# Altium schematic sheet Camera.SchDoc: Access Control
size A; DrawnBy: Q.Thang & T.Khoa; Revision: V1.0.1; SheetNumber: 9; SheetTotal: 16
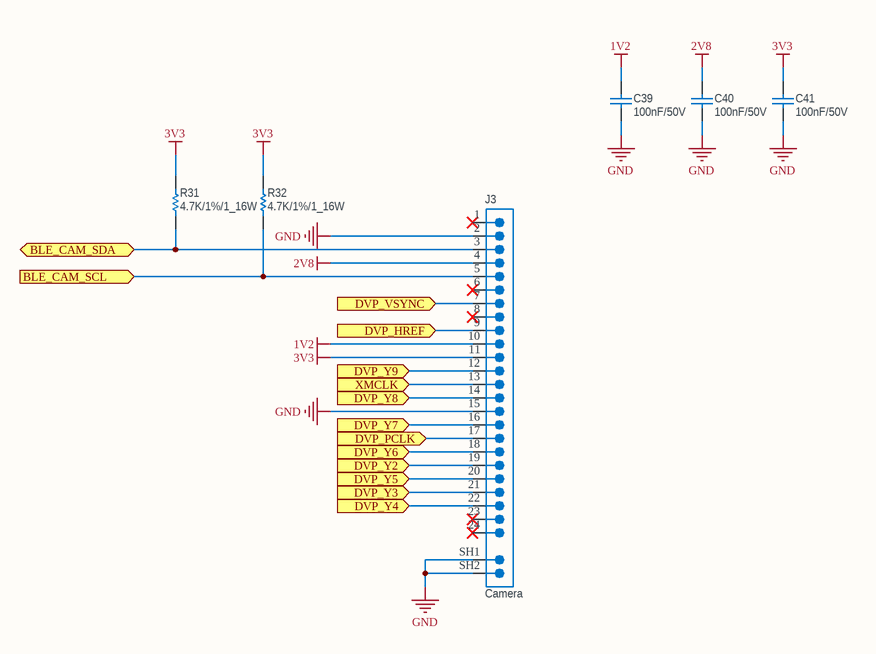
[diagram p0: Camera.SchDoc]

## Parts
C39  100nF/50V  [CAP_0402]
C40  100nF/50V  [CAP_0402]
C41  100nF/50V  [CAP_0402]
J3  Camera  [FPC_0.5mm_24P]
R31  4.7K/1%/1_16W  [RESISTOR_0402]
R32  4.7K/1%/1_16W  [RESISTOR_0402]

## Ports
BLE_CAM_SCL (in, see Overview_Schematic[3B], ESP32_BLE[3B]), BLE_CAM_SDA (bidir, see Overview_Schematic[3B], ESP32_BLE[2B]), DVP_HREF (in, see Overview_Schematic[3B], ESP32_BLE[3B]), DVP_PCLK (in, see Overview_Schematic[3B], ESP32_BLE[2B]), DVP_VSYNC (in, see Overview_Schematic[3B], ESP32_BLE[2B]), DVP_Y2 (in, see Overview_Schematic[3B], ESP32_BLE[3A]), DVP_Y3 (in, see Overview_Schematic[3B], ESP32_BLE[2B]), DVP_Y4 (in, see Overview_Schematic[3B], ESP32_BLE[2B]), DVP_Y5 (in, see Overview_Schematic[3B], ESP32_BLE[3A]), DVP_Y6 (in, see Overview_Schematic[3B], ESP32_BLE[3B]), DVP_Y7 (in, see Overview_Schematic[3B], ESP32_BLE[2B]), DVP_Y8 (in, see Overview_Schematic[3B], ESP32_BLE[2B]), DVP_Y9 (in, see Overview_Schematic[3B], ESP32_BLE[2B]), XMCLK (in, see Overview_Schematic[3B], ESP32_BLE[2B])

## Nets
1V2: C39.2 J3.10
2V8: C40.2 J3.4
3V3: C41.2 J3.11 R31.2 R32.2
GND: C39.1 C40.1 C41.1 J3.2 J3.15 J3.SH1(SHIELD) J3.SH2(SHIELD)
BLE_CAM_SCL: J3.5 R32.1 ; port BLE_CAM_SCL
BLE_CAM_SDA: J3.3 R31.1 ; port BLE_CAM_SDA
DVP_HREF: J3.9 ; port DVP_HREF
DVP_PCLK: J3.17 ; port DVP_PCLK
DVP_VSYNC: J3.7 ; port DVP_VSYNC
DVP_Y2: J3.19 ; port DVP_Y2
DVP_Y3: J3.21 ; port DVP_Y3
DVP_Y4: J3.22 ; port DVP_Y4
DVP_Y5: J3.20 ; port DVP_Y5
DVP_Y6: J3.18 ; port DVP_Y6
DVP_Y7: J3.16 ; port DVP_Y7
DVP_Y8: J3.14 ; port DVP_Y8
DVP_Y9: J3.12 ; port DVP_Y9
XMCLK: J3.13 ; port XMCLK

Not connected (* = marked no-connect by the designer): J3 1* 6* 8* 23* 24*

## Notes on the sheet
- Project Name
- Size
- A4
- Revision
- Checked By:
- Drawn By:
- Date:
- File:
- Last Modified:
- Sheet
- of

## Library data of the parts
C39-C41 = Ceramic_Cap_100nF_50V_0402: CAP, size 0402, 100nF, 50V; Supply Part Number: Tụ Gốm 0402 100nF (0.1uF) 50V; Supply Name: Thegioiic; Datasheet: *; Supply URL: https://www.thegioiic.com/tu-gom-0402-100nf-0-1uf-50v
J3 = FPC_0.5mm_24P: Cổng FPC 24 Chân 0.5mm Tiếp Điểm Trên, 0.4A 50V; Supply Name: Thegioiic; Supply Part Number: Cổng FPC 24 Chân 0.5mm Tiếp Điểm Trên; Supply URL: https://www.thegioiic.com/cong-fpc-24-chan-0-5mm-tiep-diem-tren
R31 R32 = Res_4.7K_0402_1%: Resistor 0402 4.7KOhm 1% 1_16W; Supply Part Number: Điện Trở 4.7 KOhm 0402 1%; Supply Name: Thegioiic; Supply URL: https://www.thegioiic.com/dien-tro-4-7-kohm-0402-1-